# EAGLE design tlc-matrix-controller (EAGLE 5.11)
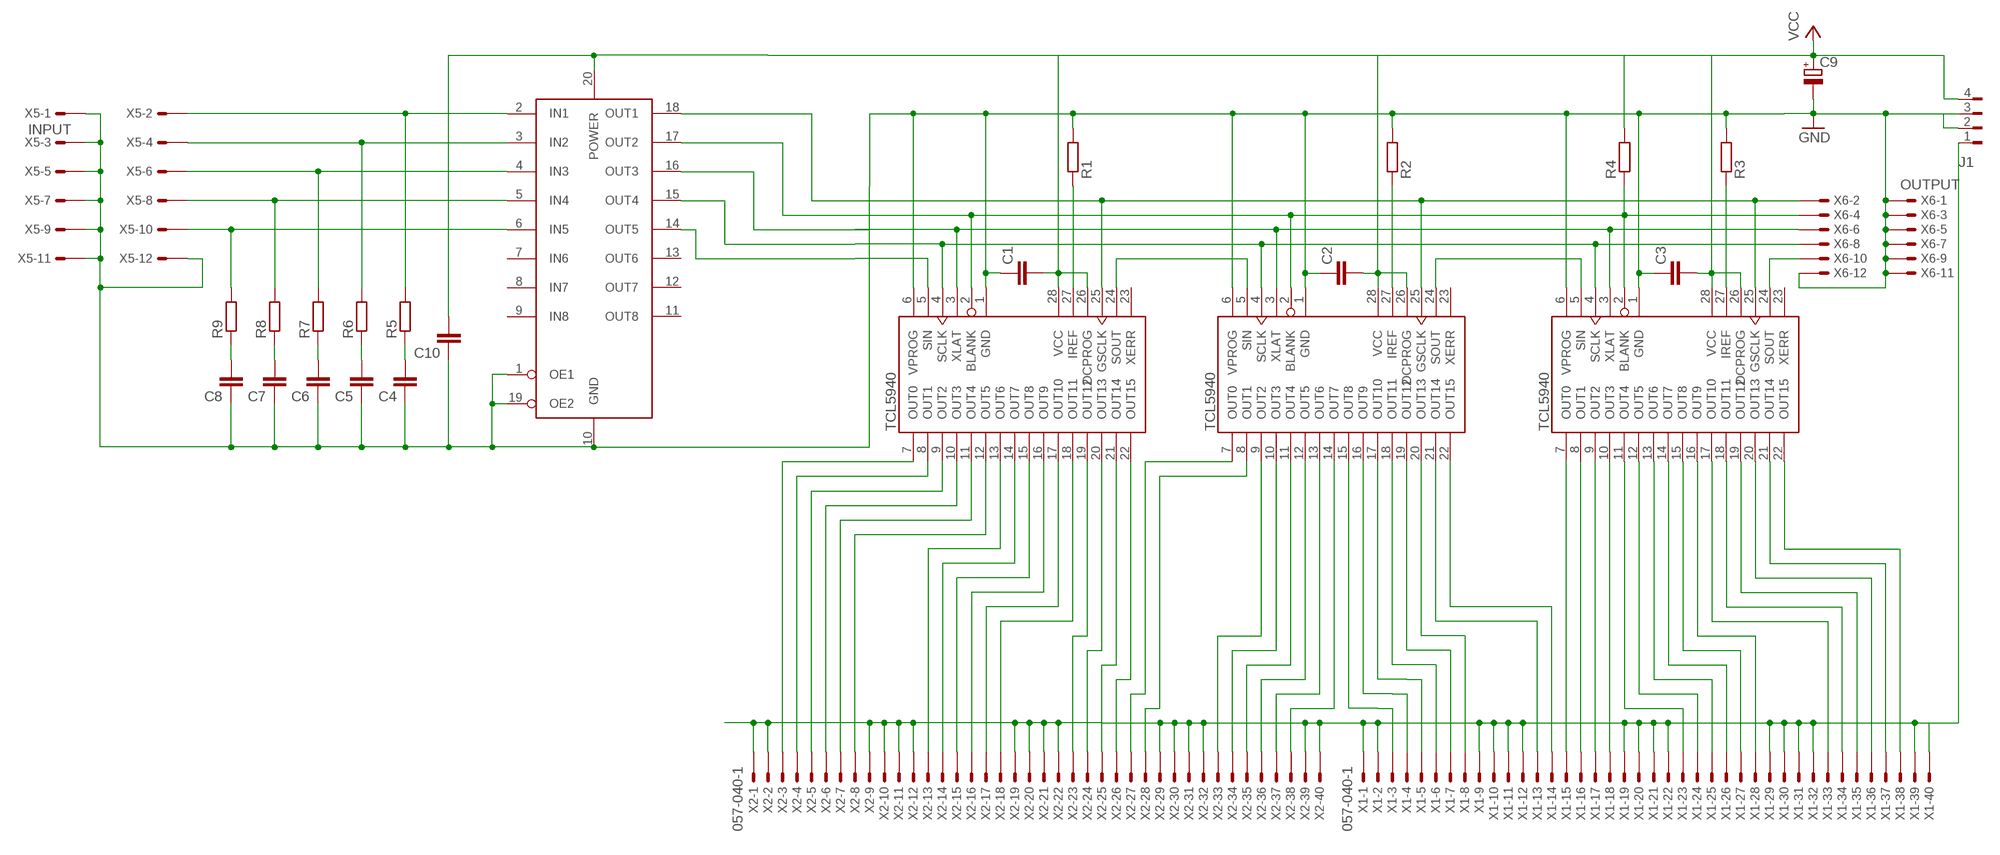
[diagram p0: schematic, sheet 1]

## Parts
C1  C-EU025-024X044  [C025-024X044]
C2  C-EU025-024X044  [C025-024X044]
C3  C-EU025-024X044  [C025-024X044]
C4  C-EU025-024X044  [C025-024X044]
C5  C-EU025-024X044  [C025-024X044]
C6  C-EU025-024X044  [C025-024X044]
C7  C-EU025-024X044  [C025-024X044]
C8  C-EU025-024X044  [C025-024X044]
C9  CPOL-EUE5-10.5  [E5-10,5]
C10  C-EU025-024X044  [C025-024X044]
IC1  TCL5940  [PW_R-PDSO-G28]
IC2  TCL5940  [PW_R-PDSO-G28]
IC3  TCL5940  [PW_R-PDSO-G28]
J1  FLOPPY-4350211  [350211]
R1  R-EU_0207/10  [0207/10-BIGPAD]
R2  R-EU_0207/10  [0207/10-BIGPAD]
R3  R-EU_0207/10  [0207/10-BIGPAD]
R4  R-EU_0207/10  [0207/10-BIGPAD]
R5  R-EU_0207/10  [0207/10]
R6  R-EU_0207/10  [0207/10]
R7  R-EU_0207/10  [0207/10]
R8  R-EU_0207/10  [0207/10]
R9  R-EU_0207/10  [0207/10]
U$1  74541  [DIL20]
X1  057-040-1  [057-040-1]
X2  057-040-1  [057-040-1]
X5  INPUT  057-012-1  [057-014-1]
X6  OUTPUT  057-012-1  [057-014-1]

## Nets
N$3: IC2.24(SOUT) IC3.5(SIN)
N$5: IC2.8(OUT1) X2.28
N$7: IC1.3(XLAT) IC2.3(XLAT) IC3.3(XLAT) U$1.16(OUT3) X6.6
N$8: IC1.8(OUT1) X2.4
N$9: IC1.27(IREF) R1.1
N$10: IC2.27(IREF) R2.1
N$11: IC3.27(IREF) R3.1
N$12: IC1.9(OUT2) X2.5
N$13: IC2.10(OUT3) X2.34
N$14: IC2.15(OUT8) X1.3
N$15: IC1.11(OUT4) X2.7
N$16: IC1.12(OUT5) X2.8
N$18: IC1.14(OUT7) X2.14
N$19: IC1.15(OUT8) X2.15
N$20: IC1.16(OUT9) X2.16
N$21: IC1.17(OUT10) X2.17
N$22: IC2.16(OUT9) X1.4
N$23: IC2.17(OUT10) X1.5
N$24: IC1.18(OUT11) X2.18
N$25: IC1.21(OUT14) X2.25
N$26: IC2.13(OUT6) X2.37
N$27: IC1.20(OUT13) X2.24
N$28: IC1.19(OUT12) X2.23
N$29: IC3.8(OUT1) X1.16
N$30: C1.1 C2.1 C3.1 C4.1 C5.1 C6.1 C7.1 C8.1 C9.- C10.1 IC1.1(GND) IC1.6(VPROG) IC2.1(GND) IC2.6(VPROG) IC3.1(GND) IC3.6(VPROG) J1.2 J1.3 R1.2 R2.2 R3.2 U$1.1(OE1) U$1.10(GND) U$1.19(OE2) X5.1 X5.3 X5.5 X5.7 X5.9 X5.11 X5.12 X6.1 X6.3 X6.5 X6.7 X6.9 X6.11 X6.12 ; supply symbol labelled GND
N$31: IC2.9(OUT2) X2.33
N$33: IC2.11(OUT4) X2.35
N$34: IC2.12(OUT5) X2.36
N$35: IC3.9(OUT2) X1.17
N$36: IC2.14(OUT7) X2.38
N$37: IC2.18(OUT11) X1.6
N$38: IC2.19(OUT12) X1.7
N$39: IC2.20(OUT13) X1.8
N$40: IC2.21(OUT14) X1.13
N$41: IC3.10(OUT3) X1.18
N$42: IC2.22(OUT15) X1.14
N$43: IC1.22(OUT15) X2.26
N$44: IC1.2(BLANK) IC2.2(BLANK) IC3.2(BLANK) R4.1 U$1.17(OUT2) X6.4
N$45: IC2.7(OUT0) X2.27
N$46: IC3.7(OUT0) X1.15
N$47: IC3.11(OUT4) X1.23
N$48: IC3.12(OUT5) X1.24
N$49: IC3.13(OUT6) X1.25
N$50: IC3.14(OUT7) X1.26
N$51: IC3.15(OUT8) X1.27
N$53: IC3.17(OUT10) X1.33
N$55: IC3.19(OUT12) X1.35
N$56: IC3.20(OUT13) X1.36
N$57: IC3.21(OUT14) X1.37
N$58: IC3.22(OUT15) X1.38
N$59: IC1.5(SIN) U$1.14(OUT5)
N$60: IC1.4(SCLK) IC2.4(SCLK) IC3.4(SCLK) U$1.15(OUT4) X6.8
N$64: IC1.24(SOUT) IC2.5(SIN)
N$67: J1.1 X1.1 X1.2 X1.9 X1.10 X1.11 X1.12 X1.19 X1.20 X1.21 X1.22 X1.29 X1.30 X1.31 X1.32 X1.39 X1.40 X2.1 X2.2 X2.9 X2.10 X2.11 X2.12 X2.19 X2.20 X2.21 X2.22 X2.29 X2.30 X2.31 X2.32 X2.39 X2.40
N$68: IC3.24(SOUT) X6.10
N$70: IC3.16(OUT9) X1.28
N$71: IC3.18(OUT11) X1.34
N$72: IC1.10(OUT3) X2.6
N$73: IC1.25(GSCLK) IC2.25(GSCLK) IC3.25(GSCLK) U$1.18(OUT1) X6.2
N$75: IC1.13(OUT6) X2.13
N$76: IC1.7(OUT0) X2.3
N$88: R5.2 U$1.2(IN1) X5.2
N$89: R6.2 U$1.3(IN2) X5.4
N$90: R7.2 U$1.4(IN3) X5.6
N$91: R8.2 U$1.5(IN4) X5.8
N$92: R9.2 U$1.6(IN5) X5.10
N$95: C5.2 R6.1
N$96: C6.2 R7.1
N$97: C7.2 R8.1
N$98: C8.2 R9.1
N$99: C4.2 R5.1
N$135: C1.2 C2.2 C3.2 C9.+ C10.2 IC1.26(DCPROG) IC1.28(VCC) IC2.26(DCPROG) IC2.28(VCC) IC3.26(DCPROG) IC3.28(VCC) J1.4 R4.2 U$1.20(POWER) ; supply symbol labelled VCC
Unconnected: IC1.23(XERR) IC2.23(XERR) IC3.23(XERR) U$1.7(IN6) U$1.8(IN7) U$1.9(IN8) U$1.11(OUT8) U$1.12(OUT7) U$1.13(OUT6)

## Library data of the parts
C1-C8 C10 = resistor:C-EU: CAPACITOR, European symbol
C9 = rcl:CPOL-EU: POLARIZED CAPACITOR, European symbol
IC1-IC3 = tcl5940smd:TCL5940: 16-Channel 12-Bit LED Driver
J1 = con-amp:FLOPPY-4: MATE N-LOCK Floppy / HDD conector Distributor: Bürklin 71F970
R1-R4 = resistor:R-EU_: RESISTOR, European symbol
R5-R9 = rcl:R-EU_: RESISTOR, European symbol
U$1 = 74xx:74*541
X1 X2 = con-panduit:057-040-: CONNECTOR 40-pin series 057 contact pc board low profile headers
X5 X6 = pinleisten:057-012-: CONNECTOR 10-pin series 057 contact pc board low profile headers

## Board
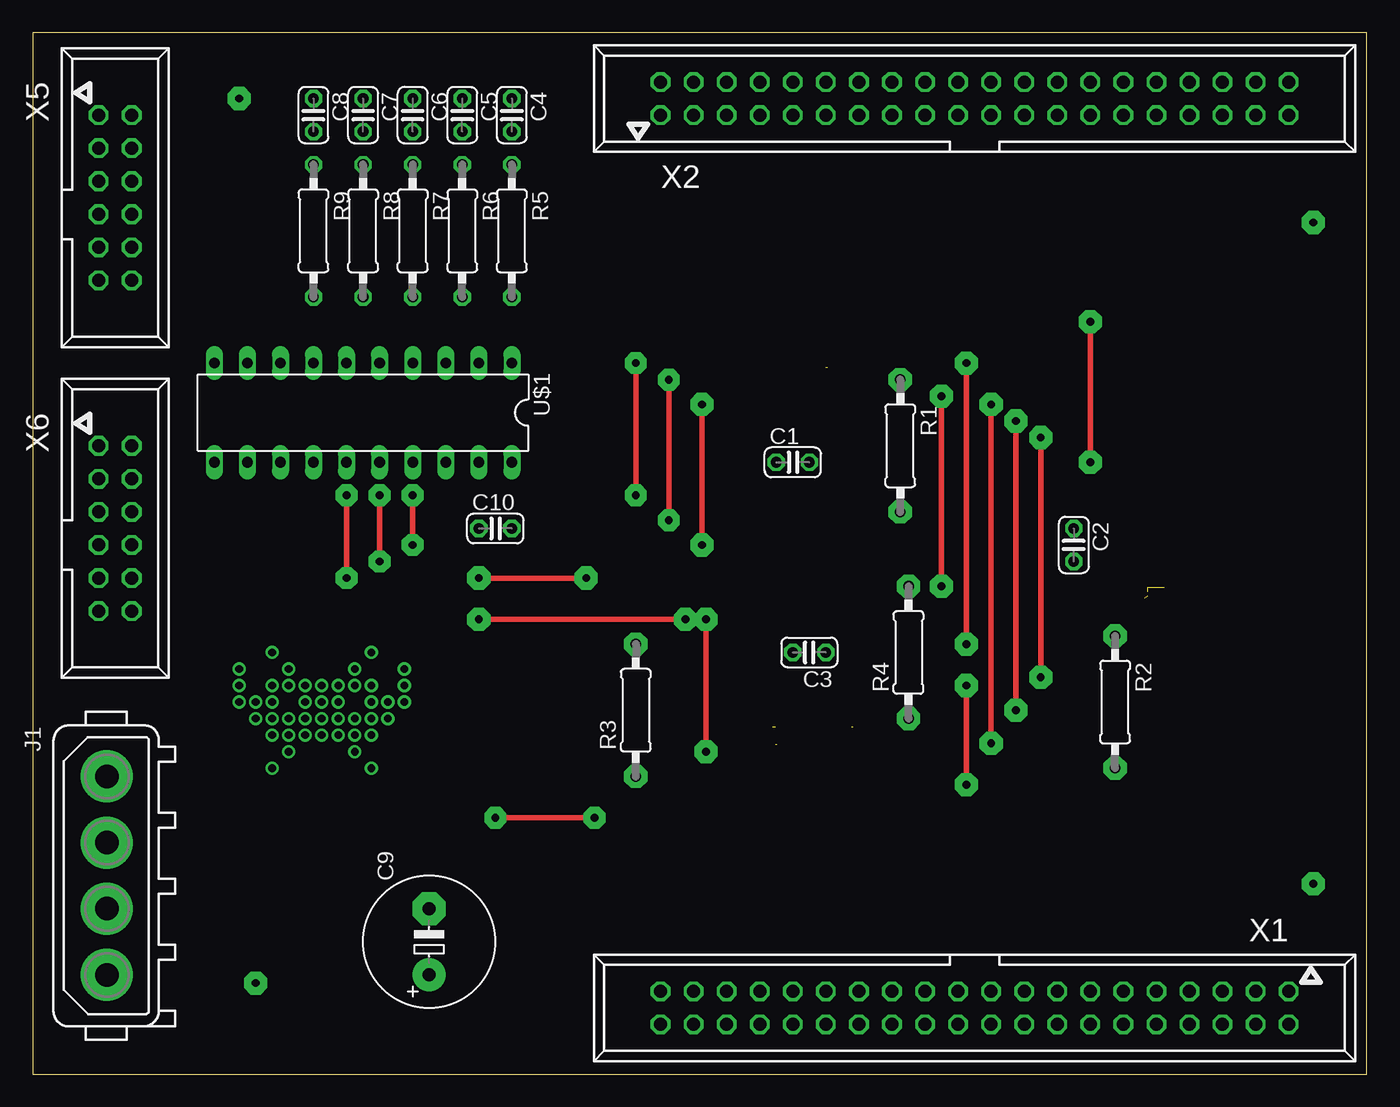
[diagram p1: board, top side]
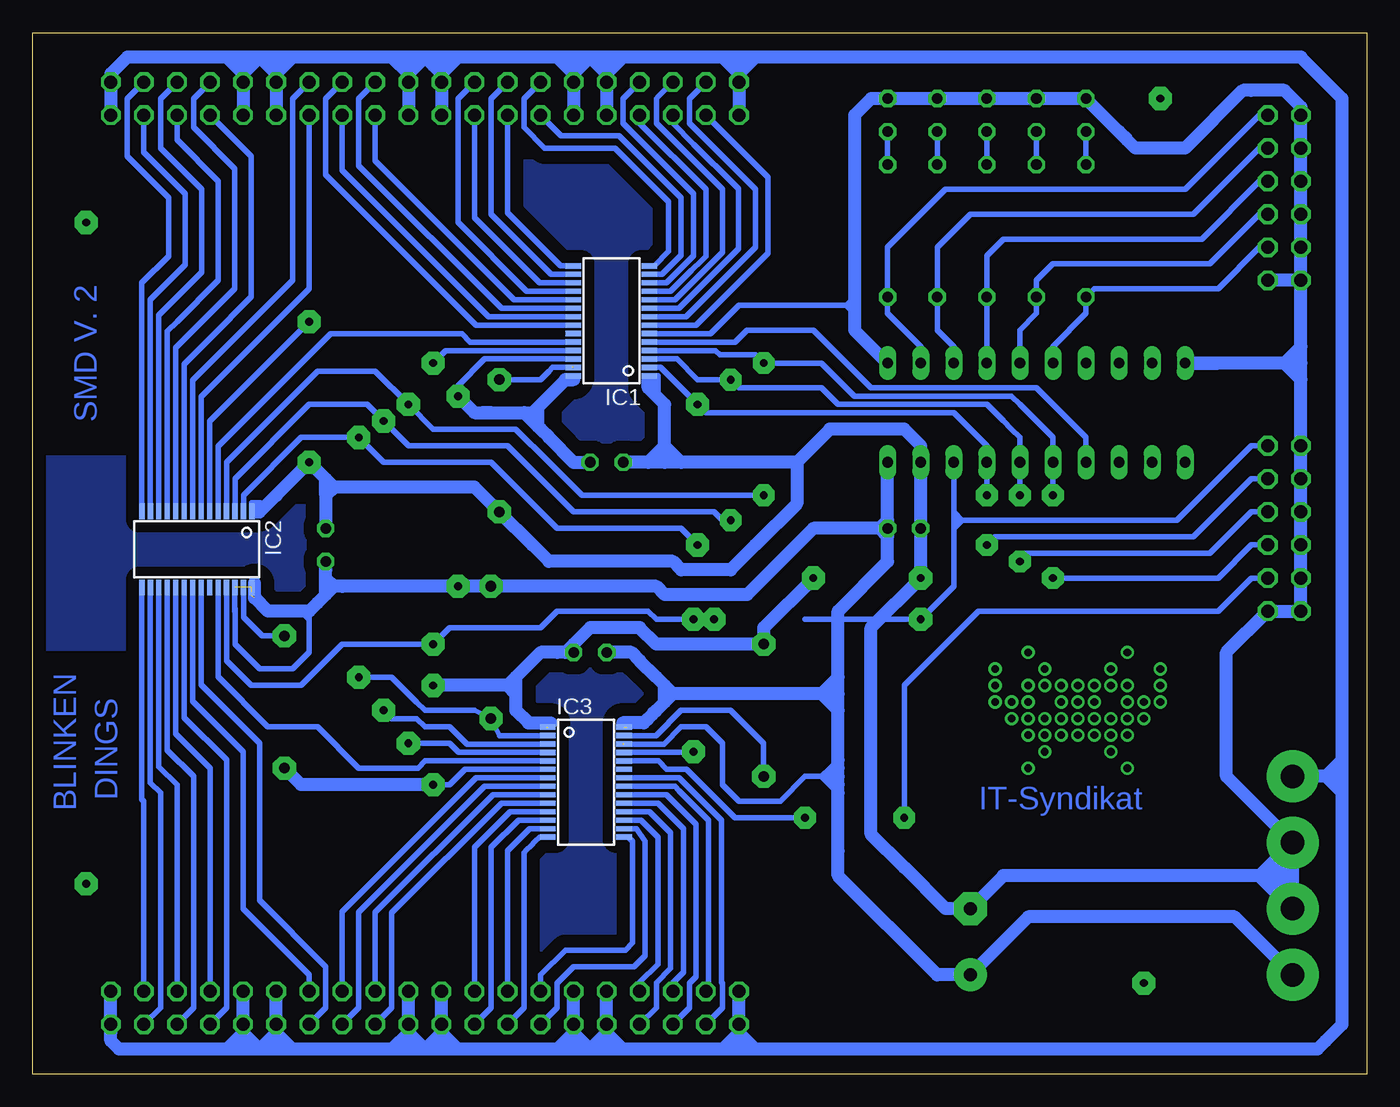
[diagram p2: board, bottom side, seen from below]

Size 102.54 x 80 mm. Coordinates in mm from the lower left corner, seen from the top.
Outline: 0,0 102.54,0 102.54,80 0,80 0,0
Copper layers (1*16): Top 0.035mm / dielectric 1.5mm / Bottom 0.035mm
Design rules "default": minimum track width 10mil, minimum drill 24mil, track to track 8mil, track to pad 8mil, pad to pad 8mil, via to via 8mil, smd to smd 8mil, copper to edge 40mil, drill to drill 8mil, minimum pad ring 10mil, minimum via ring 8mil, stop-mask expansion 4mil, vias tented up to drill 0mil, thermal gap 10mil

### Footprints (pad centres in the part's own frame; a part is rotated, then mirrored left to right if it is on the bottom)
C025-024X044 = drill 0.813 octagon: 1 -1.27,0; 2 1.27,0
E5-10,5 = drill 1.016 pad 2.54 round: + -2.54,0 | drill 1.016 pad 2.54 octagon: - 2.54,0
PW_R-PDSO-G28 = smd 0.4 x 1.2: 1 -4.225,-2.925; 2 -3.575,-2.925; 3 -2.925,-2.925; 4 -2.275,-2.925; 5 -1.625,-2.925; 6 -0.975,-2.925; 7 -0.325,-2.925; 8 0.325,-2.925; 9 0.975,-2.925; 10 1.625,-2.925; 11 2.275,-2.925; 12 2.925,-2.925; 13 3.575,-2.925; 14 4.225,-2.925; 15 4.225,2.925; 16 3.575,2.925; 17 2.925,2.925; 18 2.275,2.925; 19 1.625,2.925; 20 0.975,2.925; 21 0.325,2.925; 22 -0.325,2.925; 23 -0.975,2.925; 24 -1.625,2.925; 25 -2.275,2.925; 26 -2.925,2.925; 27 -3.575,2.925; 28 -4.225,2.925
350211 = drill 1.8 pad 4 round: 1 -7.62,0; 2 -2.54,0; 3 2.54,0; 4 7.62,0
0207/10-BIGPAD = drill 0.813 pad 1.778 octagon: 1 -5.08,0; 2 5.08,0
0207/10 = drill 0.813 octagon: 1 -5.08,0; 2 5.08,0
DIL20 = drill 0.813 long: 1 -11.43,-3.81; 2 -8.89,-3.81; 3 -6.35,-3.81; 4 -3.81,-3.81; 5 -1.27,-3.81; 6 1.27,-3.81; 7 3.81,-3.81; 8 6.35,-3.81; 9 8.89,-3.81; 10 11.43,-3.81; 11 11.43,3.81; 12 8.89,3.81; 13 6.35,3.81; 14 3.81,3.81; 15 1.27,3.81; 16 -1.27,3.81; 17 -3.81,3.81; 18 -6.35,3.81; 19 -8.89,3.81; 20 -11.43,3.81
057-040-1 = drill 1 octagon: 1 -24.13,-1.27; 2 -24.13,1.27; 3 -21.59,-1.27; 4 -21.59,1.27; 5 -19.05,-1.27; 6 -19.05,1.27; 7 -16.51,-1.27; 8 -16.51,1.27; 9 -13.97,-1.27; 10 -13.97,1.27; 11 -11.43,-1.27; 12 -11.43,1.27; 13 -8.89,-1.27; 14 -8.89,1.27; 15 -6.35,-1.27; 16 -6.35,1.27; 17 -3.81,-1.27; 18 -3.81,1.27; 19 -1.27,-1.27; 20 -1.27,1.27; 21 1.27,-1.27; 22 1.27,1.27; 23 3.81,-1.27; 24 3.81,1.27; 25 6.35,-1.27; 26 6.35,1.27; 27 8.89,-1.27; 28 8.89,1.27; 29 11.43,-1.27; 30 11.43,1.27; 31 13.97,-1.27; 32 13.97,1.27; 33 16.51,-1.27; 34 16.51,1.27; 35 19.05,-1.27; 36 19.05,1.27; 37 21.59,-1.27; 38 21.59,1.27; 39 24.13,-1.27; 40 24.13,1.27
057-014-1 = drill 1 octagon: 1 -7.62,-1.27; 2 -7.62,1.27; 3 -5.08,-1.27; 4 -5.08,1.27; 5 -2.54,-1.27; 6 -2.54,1.27; 7 0,-1.27; 8 0,1.27; 9 2.54,-1.27; 10 2.54,1.27; 11 5.08,-1.27; 12 5.08,1.27

### Placement (x,y rotation side)
C1  58.42,46.99 0 top
C2  80.01,40.64 270 top
C3  59.69,32.38 180 top
C4  36.83,73.66 270 top
C5  33.02,73.66 270 top
C6  29.21,73.66 270 top
C7  25.4,73.66 270 top
C8  21.59,73.66 270 top
C9  30.48,10.16 90 top
C10  35.56,41.91 0 top
IC1  58.06,57.85 90 bottom
IC2  89.91,40.3 180 bottom
IC3  60.01,22.43 270 bottom
J1  5.71,15.24 270 top
R1  66.67,48.26 270 top
R2  83.19,28.57 270 top
R3  46.35,27.94 90 top
R4  67.31,32.38 90 top
R5  36.83,64.77 270 top
R6  33.02,64.77 270 top
R7  29.21,64.77 270 top
R8  25.4,64.77 270 top
R9  21.59,64.77 270 top
U$1  25.4,50.8 180 top
X1  72.39,5.08 180 top
X2  72.39,74.93 0 top
X5  6.35,66.04 270 top
X6  6.35,40.64 270 top

### Tracks (layer width: path | path; a pad name or v marks a point on that pad's centre or on a via)
N$1
  pour Bottom (isolate 1.016): 53.98,29.21 56.52,31.75 63.5,31.75 64.77,30.48 64.77,27.94 63.5,27.94 62.23,26.67 62.23,17.78 63.5,17.78 64.14,17.14 64.14,7.62 61.59,10.16 57.15,10.16 56.52,10.79 56.52,17.78 57.15,17.78 57.78,18.41 57.78,27.3 55.88,27.3
N$2
  Bottom 0.406: 87,37.47 87,35.56
N$3
  Bottom 0.406: IC2.24 88.28,33.15 88.28,30.5 84.45,26.67 80.64,26.67 77.47,23.5 73.03,23.5 72.92,23.5 72.36,24.05 IC3.5
N$4
  Bottom 0.406: 54.48,52.98 54.48,53.62 | 54.48,52.98 54.48,52.65 54.48,52.98 | 54.48,52.98 54.48,53.22 54.61,53.34 54.61,52.7 | 54.48,52.33 54.48,52.98
N$5
  Bottom 0.406: X2.28 82.55,74.93 82.55,73.03 82.55,60.96 90.23,53.27 90.23,43.55 IC2.8
N$6
  Bottom 0.406: 85.69,42.9 85.03,42.9 85.03,43.55 85.69,43.55 85.69,43.88 85.03,43.88
N$7  (via drill 0.6 pad 1.68, 0.6 pad 1.78)
  Top 0.406: v75.56,50.16 v75.56,27.94 | v48.9,53.34 v48.9,42.55 | v26.67,39.37 v26.67,44.45
  Bottom 0.406: IC3.3 69.17,25.35 70.48,26.67 72.39,26.67 73.03,27.3 74.93,27.3 v75.56,27.94 | IC1.3 53.02,54.92 51.44,53.34 v48.9,53.34 | IC2.3 86.98,45.73 81.28,51.44 76.83,51.44 v75.56,50.16 73.66,48.26 66.04,48.26 60.96,43.18 50.16,43.18 49.53,42.55 v48.9,42.55 | v48.9,53.34 48.26,53.34 | X6.6 8.26,43.18 8.89,43.18 12.06,40.01 26.04,40.01 | 26.04,40.01 26.67,40.01 | v26.67,44.45 U$1.16 26.67,48.9 27.3,49.53 27.94,50.16 29.21,51.44 40.64,51.44 41.91,52.7 46.99,52.7 48.26,52.7 v48.9,53.34 | 26.04,40.01 v26.67,39.37
N$8
  Bottom 0.406: X2.4 52.07,74.93 52.07,73.03 46.99,67.94 46.99,63.82 | 46.99,63.82 46.99,63.72 | IC1.8 52.31,58.17 46.99,63.5 46.99,63.82
N$9  (1 unrouted)
  Bottom 0.406: 62.56,54.27 62.87,53.98 | 62.87,53.98 63.5,53.34 R1.1 | 62.56,54.27 61.1,54.27 | 62.56,54.27 62.87,53.98
N$10
  Bottom 0.406: IC2.27 86.33,35.1 84.89,33.66 R2.1
N$11
  Bottom 0.406: IC3.27 55.91,26 IC3.27 | 48.9,27.94 48.26,27.3 | 48.9,27.94 52.7,27.94 54.65,26 IC3.27 | R3.1 46.35,25.4 48.9,27.94
N$12
  Bottom 0.406: 53.19,58.83 IC1.9 | 53.19,58.83 52.94,58.83 | X2.5 53.34,73.03 51.75,71.44 48.58,68.26 48.31,68 48.31,63.38 52.86,58.83 53.19,58.83
N$13
  Bottom 0.406: 90.49,56.83 91.53,55.78 91.53,43.55 IC2.10 | 90.49,56.83 90.17,57.15 | X2.34 90.17,74.93 90.17,73.03 90.17,72.71 87,69.53 87,60.33 90.49,56.83
N$14
  Bottom 0.406: IC2.15 94.14,21.11 93.98,20.95 X1.3
N$15
  Bottom 0.406: IC1.11 53.51,60.12 52.21,61.42 | 52.21,61.42 51.88,61.75 | X2.7 55.88,73.03 50.8,67.94 50.8,62.84 52.21,61.42
N$16
  Bottom 0.406: X2.8 57.15,74.93 57.15,73.03 51.75,67.63 51.75,62.86 52.86,61.75 | IC1.12 53.84,60.77 52.86,61.75 | 52.86,61.75 52.53,62.08
N$17
  Bottom 0.406: 85.47,36.73 85.15,36.73
N$18
  Bottom 0.406: X2.14 64.77,74.93 64.77,73.03 64.77,72.71 63.18,71.12 57.78,71.12 53.66,66.99 53.66,63.5 | 54.77,62.08 IC1.14 54.77,62.08 | 53.66,63.5 53.66,63.23 | 54.77,62.08 53.66,63.18 53.66,63.5
N$19
  Bottom 0.406: X2.15 66.04,66.16 61.96,62.08 IC1.15
N$20
  Bottom 0.406: X2.16 67.31,74.93 67.31,73.03 67.31,66.04 62.7,61.42 IC1.16
N$21
  Bottom 0.406: X2.17 68.58,65.77 63.59,60.77 IC1.17
N$22
  Bottom 0.406: X1.4 92.71,5.08 92.71,6.99 92.71,21.59 93.48,22.36 IC2.16
N$23
  Bottom 0.406: IC2.17 92.83,23.62 91.44,22.23 X1.5
N$24
  Bottom 0.406: X2.18 69.85,74.93 69.85,73.03 69.85,65.42 64.56,60.12 IC1.18
N$25
  Bottom 0.406: X2.25 78.74,69.43 67.48,58.17 IC1.21
N$26
  Bottom 0.406: IC2.13 93.48,59.48 90.81,62.16 90.81,67.63 93.98,70.8 X2.37 93.98,72.39
N$27
  Bottom 0.406: X2.24 77.47,74.93 77.47,73.03 77.47,69.78 66.51,58.83 IC1.20
N$28
  Bottom 0.406: X2.23 76.2,70.14 65.53,59.48 IC1.19
N$29
  Bottom 0.406: X1.16 77.47,5.08 77.47,6.99 77.47,12.44 67.81,22.1 IC3.8
N$30  (via drill 0.6 pad 1.78)  (1 unrouted)
  Top 0.406: v34.29,38.1 v42.55,38.1 | v71.75,29.84 v71.75,22.23 | v81.28,46.99 v81.28,57.78
  Bottom 0.406: 50.7,56.88 51.56,56.88 | 51.56,56.88 IC1.6 | IC1.1 55.13,53.45 55.24,53.34 | IC3.6 69.11,23.4 69.31,23.4 70.48,22.23 v71.75,22.23 81.92,22.23 R2.2 | IC2.6 88.94,50.13 v81.28,57.78 | IC2.1 85.14,43.23 85.09,43.18 | 50.7,56.88 51.56,56.88 | C8.1 C7.1 C6.1 C5.1 C4.1 38.1,74.93 39.37,73.66 39.37,62.23 | C10.1 U$1.19 | 62.73,26.98 63.05,26.65 | 40.01,59.05 43.81,59.05 46.99,59.05 47.62,59.05 48.26,59.05 50.44,56.88 50.7,56.88 | 39.37,59.05 40.01,59.05 | 40.01,59.05 39.37,59.69 40.01,59.05 | 40.01,59.05 39.37,58.42
  Bottom 1.016: 64.03,26.98 63.7,26.98 | 64.03,26.98 64.44,26.98 65.41,27.94 65.41,29.21 | 65.41,30.48 65.41,29.84 | 65.41,29.84 65.41,29.21 | 65.41,30.48 63.5,32.38 61.59,32.38 | 85.09,43.18 83.82,44.45 v81.28,46.99 | 55.24,53.34 55.24,52.7 53.98,51.44 53.98,48.26 | 76.2,45.09 68.58,45.09 R1.2 64.14,40.64 62.87,39.37 53.34,39.37 52.7,38.73 48.9,38.73 46.99,40.64 43.81,43.81 43.81,46.99 | 76.2,45.09 76.83,45.09 | v71.75,22.23 81.92,22.23 R2.2 | J1.2 J1.3 8.26,15.24 | 19.05,72.39 18.41,71.75 | 19.05,72.39 C8.1 C7.1 C6.1 C5.1 C4.1 38.1,74.93 39.37,73.66 39.37,62.23 39.37,60.33 | X5.11 X5.9 X5.7 X5.5 X5.3 X5.1 5.08,74.3 6.35,75.56 8.89,75.56 9.53,75.56 13.97,71.12 17.14,71.12 17.78,71.12 19.05,72.39 | X5.11 X5.12 | 11.43,54.61 U$1.10 6.35,54.61 | J1.2 10.79,22.86 10.79,32.38 X6.12 X6.11 X6.9 X6.7 X6.5 X6.3 X6.1 5.08,53.34 | 5.08,55.88 X5.11 | 5.08,54.61 5.08,55.88 | 5.08,53.34 5.08,54.61 | 5.08,54.61 6.35,54.61 | 5.08,55.88 6.35,54.61 | 5.08,53.34 5.08,55.88 | 5.08,53.34 6.35,54.61 | 43.81,46.99 52.7,46.99 | 52.7,46.99 53.98,46.99 | 53.98,46.99 55.24,46.99 | 55.24,46.99 C1.1 | 53.98,46.99 53.98,48.26 | 52.7,46.99 53.98,48.26 | 52.7,46.99 55.24,46.99 | 53.98,48.26 55.24,46.99 | 80.01,44.45 80.01,45.72 v81.28,46.99 | 80.01,44.45 C2.1 | 39.37,60.33 39.37,59.69 | 39.37,59.69 39.37,59.05 | 39.37,59.05 39.37,58.42 | 39.37,58.42 39.37,57.78 | 39.37,57.78 39.37,57.15 U$1.1 | 39.37,60.33 39.37,59.69 | 39.37,59.69 39.37,59.05 | 39.37,59.05 39.37,58.42 | 39.37,58.42 39.37,57.78 | 8.26,15.24 27.94,15.24 C9.- 32.38,12.7 35.56,15.88 38.1,18.41 38.1,34.29 v34.29,38.1 C10.1 U$1.19 34.29,48.26 35.56,49.53 41.27,49.53 43.81,46.99 | J1.2 8.26,15.24
  Bottom 1.016: J1.2 8.26,15.24 | 60.96,33.02 C3.1 | C3.1 61.59,32.38 | 61.59,32.38 62.23,32.38 | C3.1 61.59,32.38 | 64.03,26.98 62.73,26.98 | 79.38,45.09 v81.28,46.99 | 76.2,45.09 79.38,45.09 | 79.38,45.09 80.01,44.45 | v42.55,38.1 46.35,34.29 R3.2 54.61,33.02 55.88,34.29 59.69,34.29 60.96,33.02 | 66.04,29.84 v71.75,29.84 | 65.41,29.84 66.04,29.84 | 65.41,29.84 65.41,29.21 | 66.04,29.84 65.41,29.21 | 65.41,30.48 66.04,29.84 | 60.96,33.02 C3.1 | 60.96,33.02 61.59,32.38
N$31
  Bottom 0.406: IC2.9 90.89,54.53 88.9,56.52 85.72,59.69 85.72,70.48 X2.33
N$33
  Bottom 0.406: IC2.11 92.19,57.04 91.44,57.78 88.27,60.96 88.27,68.58 91.44,71.75 X2.35
N$34
  Bottom 0.406: X2.36 92.71,74.93 92.71,73.03 92.71,71.44 92.71,71.12 89.53,67.94 89.53,61.59 92.71,58.42 92.83,58.3 IC2.12
N$35
  Bottom 0.406: X1.17 76.2,12.41 67.16,21.45 IC3.9
N$36
  Bottom 0.406: X2.38 95.25,74.93 95.25,73.03 95.25,70.48 94.3,69.53 | IC2.14 94.14,60.77 92.08,62.84 92.08,67.31 94.3,69.53 | 94.3,69.53 94.14,69.37
N$37
  Bottom 0.406: X1.6 90.17,5.08 90.17,6.99 90.17,22.86 92.19,24.88 IC2.18
N$38
  Bottom 0.406: IC2.19 91.53,26.13 88.9,23.5 X1.7
N$39
  Bottom 0.406: X1.8 87.63,5.08 87.63,6.99 87.63,24.13 90.89,27.39 IC2.20
N$40
  Bottom 0.406: IC2.21 90.23,28.64 86.36,24.77 86.36,12.7 81.28,7.62 X1.13
N$41
  Bottom 0.406: X1.18 74.93,5.08 74.93,6.99 74.93,12.38 66.51,20.8 IC3.10
N$42
  Bottom 0.406: X1.14 80.01,5.08 80.01,6.99 80.01,8.26 85.09,13.34 85.09,25.4 89.58,29.89 IC2.22
N$43
  Bottom 0.406: X2.26 80.01,74.93 80.01,73.03 80.01,69.08 68.46,57.52 IC1.22
N$44  (via drill 0.6 pad 1.68, 0.6 pad 1.78)
  Top 0.406: v77.47,48.9 v77.47,30.48 | v51.44,51.44 v51.44,40.64 | v29.21,40.64 v29.21,44.45
  Bottom 0.406: 71.12,27.94 71.75,27.94 72.39,27.94 73.03,28.57 74.93,30.48 v77.47,30.48 | 71.12,27.94 70.48,27.94 | IC1.2 54.27,54.27 v51.44,51.44 50.8,50.8 31.75,50.8 29.84,48.9 | IC3.2 66.64,26 R4.1 68.58,27.94 71.12,27.94 | IC2.2 86.33,44.48 81.92,48.9 v77.47,48.9 75.56,46.99 67.31,46.99 62.23,41.91 52.7,41.91 v51.44,40.64 | 29.21,48.26 29.84,48.9 | 29.21,48.26 U$1.17 v29.21,44.45 | X6.4 8.89,45.72 12.06,42.55 | 12.06,42.55 12.7,41.91 | v29.21,40.64 28.57,41.27 13.34,41.27 12.06,42.55 | 29.21,48.26 29.84,48.9 | 29.84,48.9 30.35,49.4
N$45
  Bottom 0.406: IC2.7 89.58,52.02 81.28,60.33 X2.27
N$46
  Bottom 0.406: X1.15 78.74,12.47 68.46,22.75 IC3.7
N$47
  Bottom 0.406: X1.23 68.58,17.43 65.86,20.15 IC3.11
N$48
  Bottom 0.406: X1.24 67.31,5.08 67.31,6.99 67.31,17.4 65.21,19.5 IC3.12
N$49
  Bottom 0.406: IC3.13 64.33,18.85 66.04,17.14 X1.25
N$50
  Bottom 0.406: X1.26 64.77,5.08 64.77,6.99 64.77,9.53 64.77,17.02 64.56,17.23 64.23,17.55 63.91,17.88 63.59,18.2 IC3.14
N$51
  Bottom 0.406: IC3.15 56.76,18.2 56.44,17.88 56.44,11.38 56.44,10.07 56.98,9.53 61.59,9.53 63.5,7.62 X1.27
N$52
  Bottom 1.016: 6.35,15.88 6.35,16.51 | 6.35,15.88 6.35,13.97 7.62,15.24 6.99,15.24 6.35,15.88
N$53
  Bottom 0.406: IC3.17 55.78,19.5 54.48,18.2 54.48,11.38 54.48,8.45 55.88,7.05 X1.33
N$55
  Bottom 0.406: IC3.19 54.48,20.8 53.84,20.15 52.53,18.85 52.53,11.38 52.53,7.8 53.34,7 X1.35
N$56
  Bottom 0.406: IC3.20 53.84,21.45 51.56,19.18 51.56,11.38 51.56,7.47 52.05,6.99 52.07,6.99 52.07,5.08 X1.36
N$57
  Bottom 0.406: IC3.21 53.19,22.1 52.86,21.77 50.59,19.5 50.59,15.93 50.59,6.83 50.8,6.61 X1.37
N$58
  Bottom 0.406: IC3.22 52.86,22.75 49.61,19.5 49.61,16.9 49.61,10.4 49.61,7.07 49.53,6.99 49.53,5.08 X1.38
N$59
  Bottom 0.406: 51.02,56.23 50.91,56.23 51.02,56.23 | 51.02,56.23 51.88,56.23 | 51.88,56.23 52.21,56.23 51.88,56.23 | 52.36,56.23 IC1.5 51.02,56.23 | 51.02,56.23 48.75,56.23 48.55,56.23 47.62,57.15 46.35,57.15 45.09,57.15 | U$1.14 21.59,48.9 | 21.59,48.9 24.13,51.44 24.77,52.07 25.4,52.7 38.1,52.7 42.55,57.15 45.09,57.15 | 21.59,48.9 25.02,52.33 | 45.09,57.15 44.8,57.15
N$60  (via drill 0.6 pad 1.68, 0.6 pad 1.78)
  Top 0.406: v73.66,51.44 v73.66,25.4 | v46.35,54.61 v46.35,44.45 | v24.13,38.1 v24.13,44.45
  Bottom 0.406: IC3.4 69.78,24.7 70.48,25.4 v73.66,25.4 | 51.88,55.58 51.74,55.58 | 51.88,55.58 IC1.4 | IC2.4 87.64,46.98 83.19,51.44 80.64,53.98 76.2,53.98 v73.66,51.44 71.75,49.53 65.41,49.53 62.87,46.99 60.33,44.45 v46.35,44.45 | 51.67,55.58 51.88,55.58 | 51.67,55.58 51.56,55.58 | 51.67,55.58 50.05,55.58 49.72,55.24 46.99,55.24 v46.35,54.61 | v46.35,54.61 45.72,54.61 | 24.13,48.9 U$1.15 v24.13,44.45 | v46.35,54.61 46.48,54.61 | X6.8 8.89,40.64 11.43,38.1 23.5,38.1 v24.13,38.1 | 24.13,48.9 26.04,50.8 | 24.13,48.9 26.67,51.44 27.3,52.07 38.73,52.07 39.37,52.07 41.91,54.61 v46.35,54.61
N$61
  Bottom 1.016: 63.7,49.73 63.7,51.02
N$62
  pour Bottom (isolate 1.016): 80.64,41.91 80.64,45.72 81.28,46.35 85.09,42.55 93.98,42.55 93.98,46.99 101.6,46.99 101.6,33.02 94.61,33.02 94.61,38.1 85.09,38.1 85.09,36.83 84.45,36.2 81.28,36.2 80.01,37.47 80.01,41.27
N$64
  Bottom 0.406: IC1.24 63.59,56.23 | 63.59,56.23 63.84,56.23 | IC2.5 88.28,48.24 80.64,55.88 80.3,56.23 80.28,56.23 79.62,56.88 69.55,56.88 68.9,56.23 63.91,56.23 63.59,56.23
N$65  (via drill 0.6 pad 0.25)
  other vias: 19.68,31.11
N$66  (via drill 0.6 pad 0.25)
  other vias: 18.41,32.38
N$67
  Bottom 0.406: X1.40 X1.39
  Bottom 1.016: X2.20 X2.19 | X2.39 X2.40 96.52,76.83 95.25,78.11 87.63,78.11 | X2.1 X2.2 48.26,76.83 | X2.10 X2.9 | X2.21 X2.22 73.66,76.83 | X2.11 X2.12 60.96,76.83 | X2.31 X2.32 86.36,76.83 | X2.29 X2.30 83.82,76.83 | X1.1 X1.2 96.52,3.17 96.52,2.54 95.89,1.91 87.63,1.91 | X1.9 X1.10 86.36,3.17 | X1.11 X1.12 83.82,3.17 | X1.19 X1.20 73.66,3.17 | X1.21 X1.22 71.12,3.17 | X1.29 X1.30 60.96,3.17 | X1.31 X1.32 58.42,3.17 | X1.39 X1.40 48.26,3.17 | 1.91,3.81 3.17,2.54 | 1.91,3.81 1.91,19.05 | 49.53,1.91 57.15,1.91 | 57.15,1.91 58.42,1.91 | 58.42,1.91 59.69,1.91 | 59.69,1.91 60.96,1.91 | 60.96,1.91 62.23,1.91 | 62.23,1.91 69.85,1.91 | 69.85,1.91 71.12,1.91 | 71.12,1.91 72.39,1.91 | 72.39,1.91 73.66,1.91 | 73.66,1.91 74.93,1.91 | 74.93,1.91 82.55,1.91 | 82.55,1.91 83.82,1.91 | 83.82,1.91 85.09,1.91 | 85.09,1.91 86.36,1.91 | 86.36,1.91 87.63,1.91 | 86.36,1.91 86.36,3.17 | 83.82,1.91 83.82,3.17 | 82.55,1.91 83.82,3.17 | 83.82,3.17 85.09,1.91 | 85.09,1.91 86.36,3.17 | 85.09,1.91 86.36,3.17 | 86.36,3.17 87.63,1.91 | 73.66,3.17 73.66,2.54 | 73.66,1.91 73.66,2.54 | 73.66,1.91 73.66,2.54 | 73.66,3.17 73.66,2.54 | 72.39,1.91 73.66,3.17 | 72.39,1.91 73.66,3.17 | 73.66,3.17 74.93,1.91 | 71.12,1.91 71.12,3.17 | 71.12,1.91 71.12,3.17 | 69.85,1.91 71.12,3.17 | 69.85,1.91 71.12,3.17 | 71.12,3.17 72.39,1.91 | 46.99,1.91 3.81,1.91 1.91,3.81 | 46.99,1.91 48.26,1.91 | 48.26,1.91 49.53,1.91 | 60.96,1.91 60.96,3.17 | 60.96,1.91 60.96,3.17 | 59.69,1.91 60.96,3.17 | 59.69,1.91 60.96,3.17 | 60.96,3.17 62.23,1.91 | 58.42,1.91 58.42,3.17 | 58.42,1.91 58.42,3.17 | 57.15,1.91 58.42,3.17 | 57.15,1.91 58.42,3.17 | 58.42,3.17 59.69,1.91 | 48.26,1.91 48.26,3.17 | 48.26,1.91 48.26,3.17 | 46.99,1.91 48.26,3.17 | 46.99,1.91 48.26,3.17
  Bottom 1.016: 48.26,3.17 49.53,1.91 | 46.99,78.11 6.35,78.11 5.08,78.11 1.91,74.93 1.91,73.66 1.91,37.47 1.91,26.67 1.91,24.13 | 46.99,78.11 48.26,78.11 | 48.26,78.11 49.53,78.11 | 49.53,78.11 52.07,78.11 57.15,78.11 | 57.15,78.11 58.42,78.11 | 58.42,78.11 59.69,78.11 | 59.69,78.11 60.96,78.11 | 60.96,78.11 62.23,78.11 | 62.23,78.11 69.85,78.11 | 69.85,78.11 71.12,78.11 | 71.12,78.11 72.39,78.11 | 72.39,78.11 73.66,78.11 | 73.66,78.11 74.93,78.11 | 74.93,78.11 82.55,78.11 | 82.55,78.11 83.82,78.11 | 83.82,78.11 85.09,78.11 | 85.09,78.11 86.36,78.11 | 86.36,78.11 87.63,78.11 | 86.36,78.11 86.36,76.83 | 86.36,78.11 86.36,76.83 | 85.09,78.11 86.36,76.83 | 85.09,78.11 87.63,78.11 | 86.36,76.83 87.63,78.11 | 83.82,78.11 83.82,76.83 | 83.82,78.11 83.82,76.83 | 82.55,78.11 83.82,76.83 | 82.55,78.11 85.09,78.11 | 83.82,76.83 85.09,78.11 | 73.66,78.11 73.66,76.83 | 73.66,78.11 73.66,76.83 | 74.93,78.11 73.66,76.83 | 72.39,78.11 74.93,78.11 | 72.39,78.11 73.66,76.83 | 72.39,78.11 73.66,76.83 | 71.12,78.11 72.39,78.11 | 71.12,78.11 71.12,76.83 | 71.12,76.83 X2.20 | 71.12,76.83 X2.20 | 71.12,76.83 71.75,77.47 72.39,78.11 | 69.85,78.11 72.39,78.11 | 69.85,78.11 71.12,76.83 | 60.96,78.11 60.96,76.83 | 60.96,78.11 60.96,76.83 | 60.96,76.83 62.23,78.11 | 60.96,76.83 62.23,78.11 | 59.69,78.11 60.96,76.83 | 58.42,78.11 59.69,78.11 | 58.42,78.11 58.42,76.83 | 58.42,76.83 X2.10 | 58.42,76.83 X2.10 | 59.69,78.11 58.42,76.83 | 57.15,78.11 59.69,78.11 | 57.15,78.11 58.42,76.83 | 48.26,78.11 48.26,76.83 | 48.26,78.11 48.26,76.83 | 49.53,78.11 48.26,76.83 | 46.99,78.11 49.53,78.11 | 46.99,78.11 48.26,76.83 | 1.91,22.86 1.91,24.13 | 1.91,20.95 1.91,22.86 | 1.91,19.05 1.91,20.95 | 1.91,19.05 1.91,20.95
  Bottom 1.016: 1.91,20.95 1.91,22.86 | 1.91,22.86 3.17,22.86 | 3.17,22.86 J1.1 3.17,22.86 | 1.91,24.13 3.17,22.86 | 1.91,20.95 1.91,24.13 | 1.91,20.95 1.91,21.59 3.17,22.86
N$68  (via drill 0.6 pad 1.68)
  Top 0.406: v35.56,19.68 v43.18,19.68
  Bottom 0.406: IC3.24 54.48,24.05 54.45,24.05 53.84,23.4 52.28,23.4 | 52.33,23.4 52.29,23.4 | 52.28,23.4 52.33,23.4 | X6.10 8.89,38.1 11.43,35.56 29.84,35.56 35.56,29.84 35.56,27.94 v35.56,19.68 | v43.18,19.68 48.57,19.68 52.28,23.4 | 52.28,23.4 52.33,23.4
N$69
  pour Bottom (isolate 1.016): 53.98,48.9 55.88,46.99 60.96,46.99 63.5,49.53 63.5,51.44 62.23,51.44 60.33,53.34 60.33,62.23 61.59,62.23 62.23,62.23 66.04,66.04 66.04,73.03 65.41,73.03 63.5,71.12 57.78,71.12 53.98,67.31 53.98,62.87 54.61,62.87 55.88,61.59 55.88,52.7 53.98,50.8
N$70
  Bottom 0.406: IC3.16 56.11,18.85 55.46,17.88 55.46,11.38 55.46,9.1 56.3,8.26 56.52,8.26 60.96,8.26 62.23,6.99 62.23,5.08 X1.28
N$71
  Bottom 0.406: IC3.18 55.13,20.15 53.51,18.52 53.51,11.38 53.51,8.12 54.61,7.03 54.61,6.99 54.61,5.08 X1.34
N$72
  Bottom 0.406: X2.6 54.48,75.06 54.61,74.93 54.61,73.03 49.53,67.94 49.53,66.36 49.53,63.13 51.56,61.1 | IC1.10 53.19,59.48 51.56,61.1 | 51.56,61.1 51.23,61.42
N$73  (via drill 0.6 pad 1.78)
  Top 0.406: v71.75,33.02 v71.75,54.61 | v51.75,34.92 v51.75,24.77 | v34.29,34.92 v50.16,34.92
  Bottom 0.406: 87.64,34.77 87.64,34.3 | 87.64,34.77 IC2.25 | v71.75,33.02 71.12,33.02 | IC3.25 53.51,24.7 53.41,24.7 52.45,24.7 v51.75,24.77 | v50.16,34.92 v51.75,34.92 54.61,34.92 55.24,35.56 62.23,35.56 63.5,34.29 69.85,34.29 70.48,34.29 v71.75,33.02 | IC1.25 70.79,55.58 v71.75,54.61 | 87.64,33.48 87.64,31.75 87.63,31.75 85.72,29.84 81.92,29.84 78.74,33.02 v71.75,33.02 | 87.64,33.48 87.64,34.12 | 43.18,34.92 v34.29,34.92 31.75,37.47 31.75,41.91 | 87.64,33.48 87.64,34.77 | 31.75,42.55 31.75,41.91 | 31.75,42.55 31.75,43.18 | 31.75,43.18 U$1.18 | X6.2 8.89,48.26 14.61,42.55 31.11,42.55 | 31.11,42.55 31.75,42.55 | 31.11,42.55 31.75,41.91 | 31.11,42.55 31.75,43.18
N$74  (via drill 0.6 pad 1.78)
  other vias: 15.88,74.93
N$75
  Bottom 0.406: IC1.13 54.16,61.42 53.51,62.08 | 53.51,62.08 53.19,62.4 | X2.13 61.91,72.07 57.47,72.07 56.2,70.8 52.7,67.31 52.7,64.77 52.7,62.88 53.51,62.08
N$76
  Bottom 0.406: 48.31,60.77 51.56,57.52 IC1.7 | 48.31,60.77 47.62,61.46 | X2.3 46.04,68.9 46.04,63.18 46.04,63.05 48.31,60.77
N$77  (via drill 0.6 pad 1.78)
  other vias: 98.42,65.41
N$78  (via drill 0.6 pad 1.78)
  other vias: 98.42,14.61
N$79  (via drill 0.6 pad 1.78)
  other vias: 17.14,6.99
N$81  (via drill 0.6 pad 0.25)
  other vias: 15.88,31.11
N$82  (via drill 0.6 pad 0.25)
  other vias: 15.88,29.84
N$83  (via drill 0.6 pad 0.25)
  other vias: 15.88,28.57
N$84  (via drill 0.6 pad 0.25)
  other vias: 17.14,28.57
N$85  (via drill 0.6 pad 0.25)
  other vias: 17.14,27.3
N$86  (via drill 0.6 pad 0.25)
  other vias: 18.41,28.57
N$87  (via drill 0.6 pad 0.25)
  other vias: 18.41,27.3
N$88
  Bottom 0.406: U$1.2 34.29,55.88 36.83,58.42 R5.2 36.83,63.5 32.38,67.94 16.51,67.94 13.97,67.94 8.26,73.66 X5.2
N$89
  Bottom 0.406: U$1.3 31.75,55.88 33.02,57.15 R6.2 33.02,63.5 30.48,66.04 15.88,66.04 13.34,66.04 8.26,71.12 X5.4
N$90
  Bottom 0.406: U$1.4 R7.2 29.21,62.87 27.94,64.14 14.61,64.14 12.7,64.14 8.26,68.58 X5.6
N$91
  Bottom 0.406: U$1.5 26.67,57.15 25.4,58.42 R8.2 25.4,60.96 24.13,62.23 13.34,62.23 12.06,62.23 8.26,66.04 X5.8
N$92
  Bottom 0.406: U$1.6 24.13,55.88 21.59,58.42 R9.2 20.95,60.33 12.06,60.33 11.43,60.33 8.26,63.5 X5.10
N$93  (via drill 0.6 pad 0.25)
  other vias: 18.41,26.04
N$94  (via drill 0.6 pad 0.25)
  other vias: 18.41,29.84
N$95
  Bottom 0.406: R6.1 C5.2
N$96
  Bottom 0.406: R7.1 C6.2
N$97
  Bottom 0.406: R8.1 C7.2
N$98
  Bottom 0.406: R9.1 C8.2
N$99
  Bottom 0.406: R5.1 C4.2
N$101  (via drill 0.6 pad 0.25)
  other vias: 19.68,29.84
N$102  (via drill 0.6 pad 0.25)
  other vias: 19.68,27.3
N$103  (via drill 0.6 pad 0.25)
  other vias: 19.68,26.04
N$104  (via drill 0.6 pad 0.25)
  other vias: 18.41,23.5
N$105  (via drill 0.6 pad 0.25)
  other vias: 20.95,29.84
N$106  (via drill 0.6 pad 0.25)
  other vias: 20.95,28.57
N$107  (via drill 0.6 pad 0.25)
  other vias: 20.95,27.3
N$108  (via drill 0.6 pad 0.25)
  other vias: 20.95,26.04
N$109  (via drill 0.6 pad 0.25)
  other vias: 22.23,29.84
N$110  (via drill 0.6 pad 0.25)
  other vias: 22.23,28.57
N$111  (via drill 0.6 pad 0.25)
  other vias: 22.23,27.3
N$112  (via drill 0.6 pad 0.25)
  other vias: 22.23,26.04
N$113  (via drill 0.6 pad 0.25)
  other vias: 23.5,29.84
N$114  (via drill 0.6 pad 0.25)
  other vias: 23.5,28.57
N$115  (via drill 0.6 pad 0.25)
  other vias: 23.5,27.3
N$116  (via drill 0.6 pad 0.25)
  other vias: 23.5,26.04
N$117  (via drill 0.6 pad 0.25)
  other vias: 24.77,29.84
N$118  (via drill 0.6 pad 0.25)
  other vias: 24.77,27.3
N$119  (via drill 0.6 pad 0.25)
  other vias: 24.77,26.04
N$120  (via drill 0.6 pad 0.25)
  other vias: 26.04,29.84
N$121  (via drill 0.6 pad 0.25)
  other vias: 26.04,28.57
N$122  (via drill 0.6 pad 0.25)
  other vias: 26.04,27.3
N$123  (via drill 0.6 pad 0.25)
  other vias: 26.04,26.04
N$124  (via drill 0.6 pad 0.25)
  other vias: 27.3,28.57
N$125  (via drill 0.6 pad 0.25)
  other vias: 27.3,27.3
N$126  (via drill 0.6 pad 0.25)
  other vias: 28.57,28.57
N$127  (via drill 0.6 pad 0.25)
  other vias: 28.57,29.84
N$128  (via drill 0.6 pad 0.25)
  other vias: 28.57,31.11
N$130  (via drill 0.6 pad 0.25)
  other vias: 24.77,24.77
N$131  (via drill 0.6 pad 0.25)
  other vias: 26.04,23.5
N$132  (via drill 0.6 pad 0.25)
  other vias: 19.68,24.77
N$133  (via drill 0.6 pad 0.25)
  other vias: 24.77,31.11
N$134  (via drill 0.6 pad 0.25)
  other vias: 26.04,32.38
N$135  (via drill 0.6 pad 1.78)  (5 unrouted)
  Top 0.406: v69.85,37.47 v69.85,52.07
  Bottom 0.406: 57.2,25.35 54.02,25.35 52.7,26.67 50.8,26.67 49.53,25.4 49.53,22.23 48.26,20.95 45.09,20.95 43.18,22.86 41.91,22.86 | 86.98,34.45 86.98,33.01 85.09,31.11 82.55,31.11 81.28,32.38 81.28,34.92 | 86.98,34.45 86.98,34.77 | 60.98,53.37 IC1.28 60.98,53.37 | 60.98,53.37 60.96,53.34 60.98,53.37 | IC1.26 67.81,54.92 69.85,52.88 v69.85,52.07 | 86.98,34.91 86.98,35.75 86.98,34.45 | 85.33,37.7 85.47,37.7 85.69,37.7 | 85.69,37.05 85.69,36.73 | C10.2 36.83,42.55 U$1.20 | 41.27,22.86 40.64,22.86 | 41.91,22.86 41.27,22.86 | 41.91,22.86 41.27,22.86 | 41.91,22.86 41.27,23.5 | 41.27,23.5 40.64,24.13 40.64,23.5 | 40.64,23.5 40.64,22.23 40.64,21.59 41.27,22.23 | 41.27,22.23 41.91,22.86 | 41.91,22.86 41.27,22.86 | 41.27,22.86 40.64,23.5 | 40.64,23.5 41.27,23.5 | 41.27,22.86 41.27,23.5 | 41.27,22.23 41.27,22.86 | 80.01,37.47 80.01,36.83 | 57.2,26.98 56.88,26.65 | 81.28,35.56 81.28,34.92 | 81.92,35.56 81.28,34.92
  Bottom 1.016: 53.34,29.21 53.98,28.57 | 53.98,28.57 54.61,27.94 | 54.61,27.94 54.92,27.62 | C10.2 36.83,42.55 | 36.83,42.55 U$1.20 | C9.+ 31.11,7.62 | 40.64,27.94 40.64,24.13 40.64,23.5 40.64,22.86 40.64,22.23 40.64,21.59 40.64,17.14 40.64,15.24 33.02,7.62 C9.+ | 40.64,27.94 40.64,29.21 | 40.64,29.21 40.64,30.48 | 40.64,30.48 40.64,35.56 36.83,39.37 36.83,41.27 | 36.83,41.27 C10.2 | 40.64,29.21 41.91,29.21 | 41.91,29.21 53.34,29.21 | 53.34,29.21 53.98,29.84 | 53.98,29.84 54.61,30.48 | 54.61,30.48 55.88,31.75 | 54.61,30.48 55.88,31.75 | C10.2 37.47,41.91 | 37.47,41.91 42.55,41.91 47.62,36.83 48.26,36.83 48.9,36.83 53.98,36.83 54.61,37.47 R4.2 69.22,37.47 v69.85,37.47 78.74,37.47 79.38,37.47 | C1.2 60.96,46.99 62.87,48.9 63.5,49.53 64.77,50.8 | 67.31,50.8 67.94,50.8 | 67.31,50.8 64.77,50.8 | 79.38,37.47 80.01,37.47 | 80.01,38.1 80.01,38.73 | 80.01,38.73 C2.2 | 79.38,37.47 80.01,38.1 | 79.38,37.47 80.01,38.1 | C9.+ 26.04,12.06 10.16,12.06 J1.4 | 41.91,29.21 40.64,30.48 | 40.64,27.94 41.91,29.21 | 55.88,31.75 56.52,32.38 C3.2 | 37.47,41.91 36.83,42.55 | 36.83,41.27 37.47,41.91 | 57.2,26.98 55.58,26.98 55.24,27.3 54.61,27.94 | 53.98,28.57 53.98,29.84 | 85.47,37.7 85.47,36.58 84.45,35.56 81.92,35.56 81.28,35.56 80.64,36.2 | 80.64,36.2 80.01,36.83 | 80.01,36.83 80.01,38.73 | 80.64,36.2 80.01,36.83 | 79.38,37.47 80.64,36.2 | 64.77,50.8 64.14,50.8 61.59,53.34 60.96,53.34 | v69.85,52.07 68.58,50.8 67.31,50.8

### Text on the board
Bottom: SMD V. 2 | BLINKEN | DINGS | IT-Syndikat